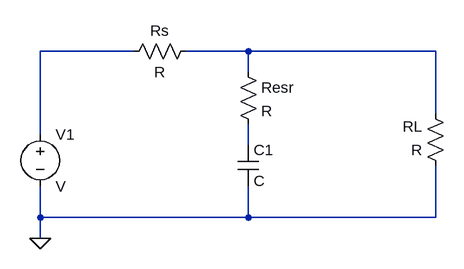
[diagram p0: schematic filter_capacitor.asc]
filter_capacitor.asc, the LTspice schematic file:
Version 4
SHEET 1 964 680
WIRE 192 -336 48 -336
WIRE 368 -336 272 -336
WIRE 656 -336 368 -336
WIRE 368 -304 368 -336
WIRE 656 -240 656 -336
WIRE 48 -208 48 -336
WIRE 368 -192 368 -224
WIRE 48 -80 48 -128
WIRE 368 -80 368 -128
WIRE 368 -80 48 -80
WIRE 656 -80 656 -160
WIRE 656 -80 368 -80
WIRE 48 -48 48 -80
FLAG 48 -48 0
SYMBOL cap 352 -192 R0
SYMATTR InstName C1
SYMBOL res 672 -144 R180
WINDOW 0 36 76 Left 2
WINDOW 3 36 40 Left 2
SYMATTR InstName RL
SYMBOL voltage 48 -224 R0
SYMATTR InstName V1
SYMBOL res 288 -352 R90
WINDOW 0 0 56 VBottom 2
WINDOW 3 32 56 VTop 2
SYMATTR InstName Rs
SYMBOL res 352 -320 R0
SYMATTR InstName Resr

The netlist it stands for:
* filter_capacitor.asc
C1 N003 0 C
RL 0 N002 R
V1 N001 0 V
Rs N002 N001 R
Resr N002 N003 R
.backanno
.end